# Altium schematic sheet hs3.schdoc
size 229 x 194 mm
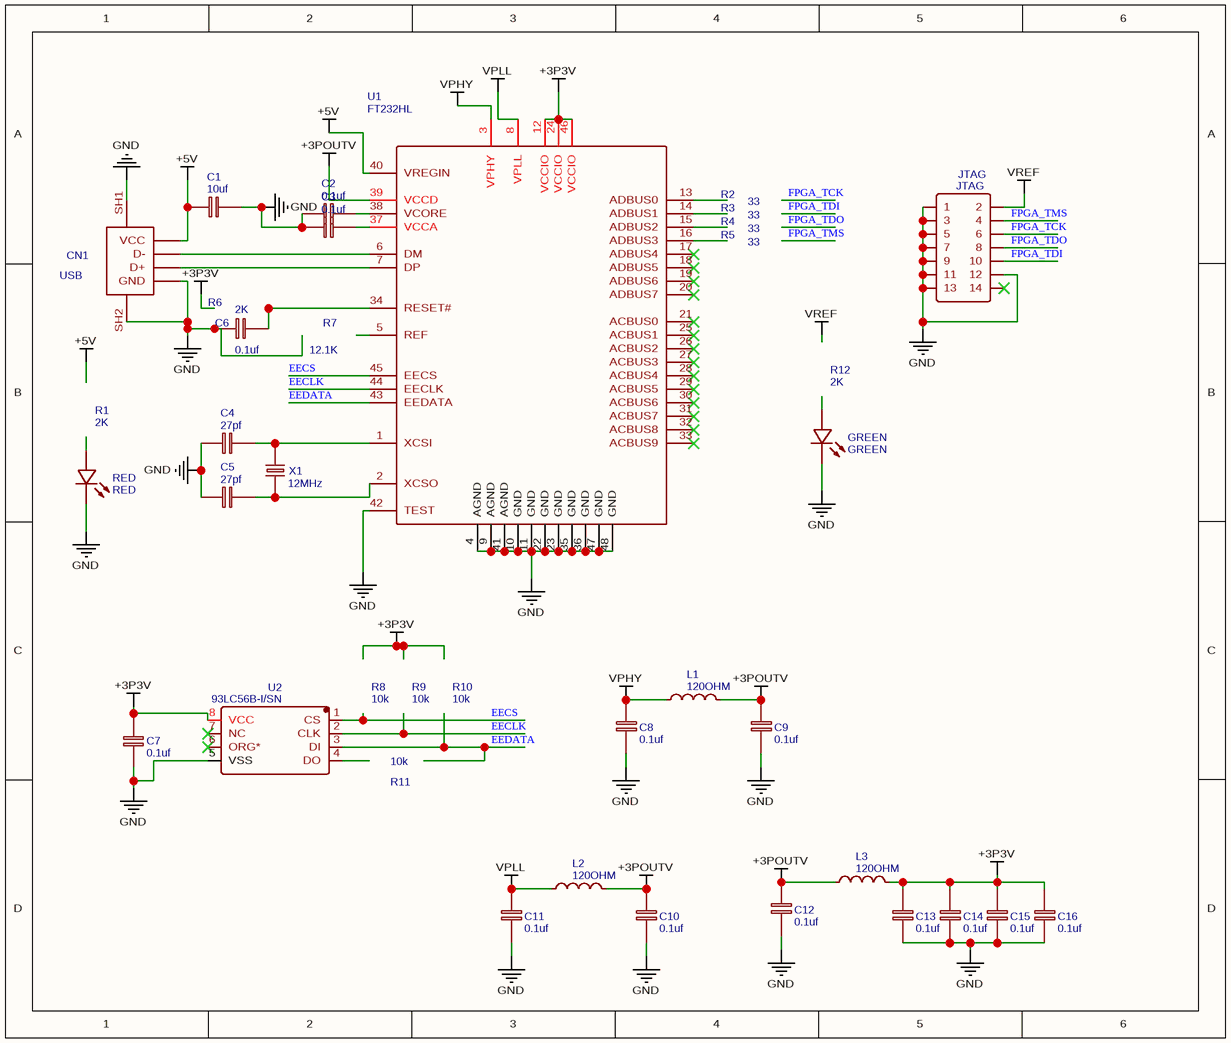
[diagram p0: hs3.schdoc]

## Parts
C1  10uf  [C0805]
C2  0.1uf  [C0805]
C3  0.1uf  [C0805]
C4  27pf  [C0805]
C5  27pf  [C0805]
C6  0.1uf  [C0805]
C7  0.1uf  [C0805]
C8  0.1uf  [C0805]
C9  0.1uf  [C0805]
C10  0.1uf  [C0805]
C11  0.1uf  [C0805]
C12  0.1uf  [C0805]
C13  0.1uf  [C0805]
C14  0.1uf  [C0805]
C15  0.1uf  [C0805]
C16  0.1uf  [C0805]
CN1  USB  [USB-B_4PIN-FEMALE_BF90]
GREEN  GREEN  [LED-0805]
JTAG  JTAG  [HDR-TH_14PIN-V-ROW2-COL7-MALE-PITCH2.54]
L1  120OHM  [L1206]
L2  120OHM  [L1206]
L3  120OHM  [L1206]
R1  2K  [0805]
R2  33  [0805]
R3  33  [0805]
R4  33  [0805]
R5  33  [0805]
R6  2K  [0805]
R7  12.1K  [0805]
R8  10k  [0805]
R9  10k  [0805]
R10  10k  [0805]
R11  10k  [0805]
R12  2K  [0805]
RED  RED  [LED-0805]
U1  FT232HL  [LQFP-48_7X7X05P]
U2  93LC56B-I/SN  [SOIC-8_L5.0-W4.0-P1.27-LS6.0-BL]
X1  12MHz  [HC-49S]

## Nets
+3P3V: C7.2 C13.1 C14.1 C15.1 C16.1 L3.2 U1.12(VCCIO) U1.24(VCCIO) U1.46(VCCIO) U2.8(VCC)
+3POUTV: C9.1 C10.1 C12.1 L1.2 L2.2 L3.1 U1.39(VCCD)
+5V: C1.1 CN1.1(VCC) U1.40(VREGIN)
GND: C1.2 C2.1 C3.1 C4.1 C5.1 C6.1 C7.1 C8.2 C9.2 C10.2 C11.2 C12.2 C13.2 C14.2 C15.2 C16.2 CN1.4(GND) CN1.SH1 CN1.SH2 GREEN.2(K) JTAG.1 JTAG.3 JTAG.5 JTAG.7 JTAG.9 JTAG.11 JTAG.12 JTAG.13 RED.2(K) U1.4(AGND) U1.9(AGND) U1.10(GND) U1.11(GND) U1.22(GND) U1.23(GND) U1.35(GND) U1.36(GND) U1.41(AGND) U1.42(TEST) U1.47(GND) U1.48(GND) U2.5(VSS)
VPHY: C8.1 L1.1 U1.3(VPHY)
VPLL: C11.1 L2.1 U1.8(VPLL)
VREF: JTAG.2
EECLK: U1.44(EECLK) U2.2(CLK)
EECS: U1.45(EECS) U2.1(CS)
EEDATA: U1.43(EEDATA) U2.3(DI)
FPGA_TCK: JTAG.6
FPGA_TDI: JTAG.10
FPGA_TDO: JTAG.8
FPGA_TMS: JTAG.4
NetC2_2: C2.2 U1.38(VCORE)
NetC3_2: C3.2 U1.37(VCCA)
NetC4_2: C4.2 U1.1(XCSI) X1.2
NetC5_2: C5.2 U1.2(XCSO) X1.1
NetC6_2: C6.2 U1.34(RESET#)
NetCN1_2: CN1.2(D-) U1.6(DM)
NetCN1_3: CN1.3(D+) U1.7(DP)

Not connected (* = marked no-connect by the designer): GREEN 1(A); JTAG 14*; RED 1(A); U1 5(REF) 13(ADBUS0) 14(ADBUS1) 15(ADBUS2) 16(ADBUS3) 17(ADBUS4)* 18(ADBUS5)* 19(ADBUS6)* 20(ADBUS7)* 21(ACBUS0)* 25(ACBUS1)* 26(ACBUS2)* 27(ACBUS3)* 28(ACBUS4)* 29(ACBUS5)* 30(ACBUS6)* 31(ACBUS7)* 32(ACBUS8)* 33(ACBUS9)*; U2 4(DO) 6(ORG*)* 7(NC)*

## Library data of the parts
C1 = 10uf: nameAlias: Value(F); spicePre: C; spiceSymbolName: Cap_RAD-0.1_EU
C2 C3 C6-C16 = 0.1uf: nameAlias: Value(F); spicePre: C; spiceSymbolName: Cap_RAD-0.1_EU
C4 C5 = 27pf: nameAlias: Value(F); spicePre: C; spiceSymbolName: Cap_RAD-0.1_EU
CN1 = USB: BOM_Manufacturer: ValuePro; BOM_Manufacturer Part: USB-BF90; BOM_Supplier: LCSC; image: //image.lceda.cn/szlcsc/C46392.jpg; BOM_Supplier Part: C46392; spicePre: C
GREEN = GREEN: BOM_Manufacturer: KENTO; BOM_Manufacturer Part: whiteLEDSMD; SMT Type: Basic; BOM_Supplier: LCSC; BOM_LCSC Assembly: Yes; image: //image.lceda.cn/szlcsc/C34499.jpg; BOM_Supplier Part: C34499; spicePre: L
JTAG = JTAG: BOM_Manufacturer: BOOMELE; BOM_Manufacturer Part: Double row of needle2X7P 2.54mm; BOM_Supplier: LCSC; BOM_Supplier Part: C71397; spicePre: J
L1-L3 = 120OHM: nameAlias: Value(H); spicePre: L; spiceSymbolName: Inductor_AXIAL-0.4_US
R1 R6 R12 = 2K: BOM_Manufacturer: RALEC; BOM_Manufacturer Part: RTT0510R5FTP; nameAlias: Resistance (Ohms); BOM_Supplier: LCSC; BOM_Supplier Part: C103927; spicePre: R; spiceSymbolName: RTT0510R5FTP
R2-R5 = 33: BOM_Manufacturer: RALEC; BOM_Manufacturer Part: RTT0510R5FTP; nameAlias: Resistance (Ohms); BOM_Supplier: LCSC; BOM_Supplier Part: C103927; spicePre: R; spiceSymbolName: RTT0510R5FTP
R7 = 12.1K: BOM_Manufacturer: RALEC; BOM_Manufacturer Part: RTT0510R5FTP; nameAlias: Resistance (Ohms); BOM_Supplier: LCSC; BOM_Supplier Part: C103927; spicePre: R; spiceSymbolName: RTT0510R5FTP
R8-R11 = 10k: BOM_Manufacturer: RALEC; BOM_Manufacturer Part: RTT0510R5FTP; nameAlias: Resistance (Ohms); BOM_Supplier: LCSC; BOM_Supplier Part: C103927; spicePre: R; spiceSymbolName: RTT0510R5FTP
RED = RED: BOM_Manufacturer: KENTO; BOM_Manufacturer Part: whiteLEDSMD; SMT Type: Basic; BOM_Supplier: LCSC; BOM_LCSC Assembly: Yes; image: //image.lceda.cn/szlcsc/C34499.jpg; BOM_Supplier Part: C34499; spicePre: L
U1 = FT232HL: BOM_Manufacturer: FTDI; sourceId: xCYSoUOId; SMT Type: Extend; timeStamp: 1473054166; BOM_Supplier: LCSC; BOM_Manufacturer Part: FT232HL; image: //image.lceda.cn/szlcsc/C51997.jpg; BOM_Supplier Part: C51997; BOM_LCSC Assembly: Yes; spicePre: U
U2 = 93LC56B-I/SN: BOM_Manufacturer: Microchip Tech; Contributor: LCSC; BOM_Supplier: LCSC; BOM_Supplier Part: C183620; BOM_Manufacturer Part: 93LC56B-I/SN; spicePre: U
X1 = 12MHz: BOM_Manufacturer: TAE; BOM_Manufacturer Part: HC-49S12MHz20pF30PPM; nameAlias: Frequency; Contributor: LCSC; BOM_Supplier: LCSC; BOM_Supplier Part: C127674; spicePre: X; spiceSymbolName: HC-49S12MHZ20PF30PPM